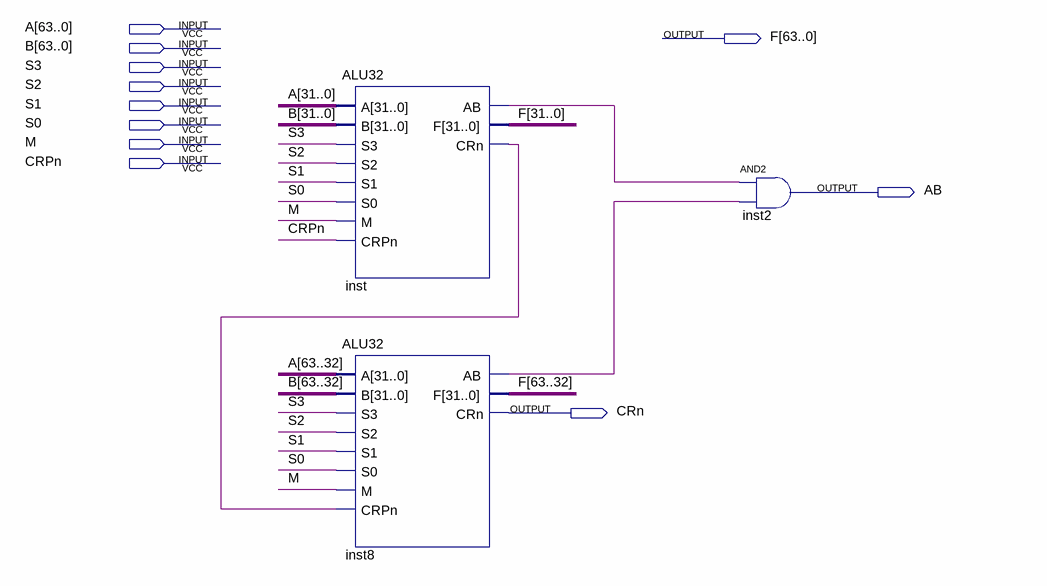
[diagram p0: schematic sheet]
// Quartus schematic ALU64.bdf as structural Verilog: 3 symbols, 11 pins
module ALU64 (
  input  [63:0] A,
  input  [63:0] B,
  input  S3,
  input  S2,
  input  S1,
  input  S0,
  input  M,
  input  CRPn,
  output [63:0] F,
  output AB,
  output CRn
);

  wire inst8_ab, inst_ab, inst_crn;

  ALU32 inst (
    .A(A[31:0]), .B(B[31:0]), .S3(S3), .S2(S2), .S1(S1), .S0(S0), .M(M), .CRPn(CRPn), .AB(inst_ab),
    .F(F[31:0]), .CRn(inst_crn));
  ALU32 inst8 (
    .A(A[63:32]), .B(B[63:32]), .S3(S3), .S2(S2), .S1(S1), .S0(S0), .M(M), .CRPn(inst_crn), .AB(inst8_ab),
    .F(F[63:32]), .CRn(CRn));
  and inst2 (AB, inst_ab, inst8_ab);
endmodule
